# Altium schematic sheet v0.SchDoc
size A
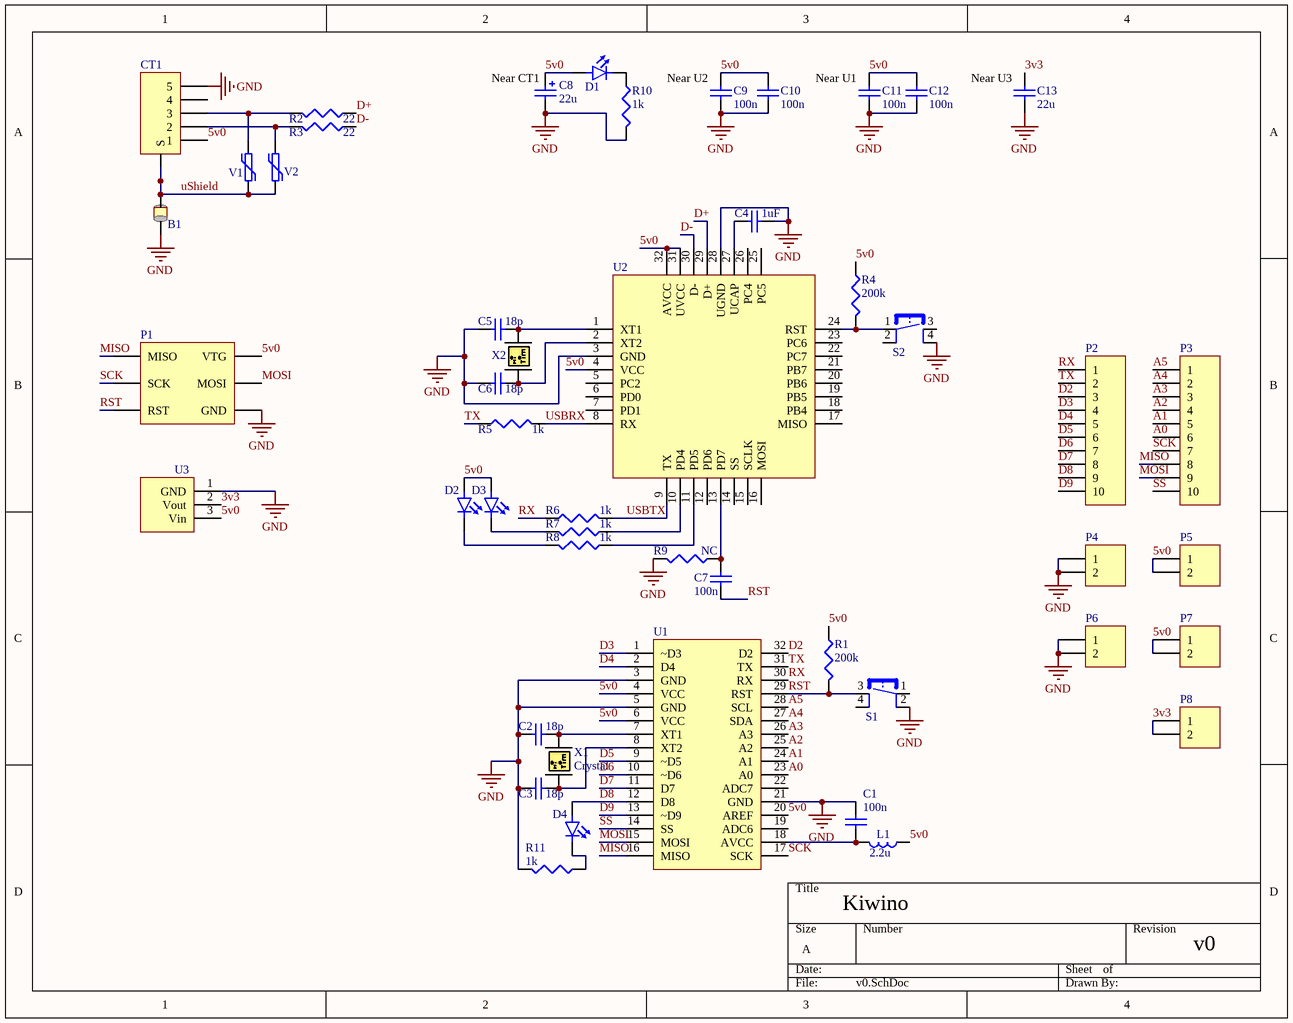
[diagram p0: v0.SchDoc]

## Parts
B1  Ferrite Bead  [smd0603]  (value not drawn)
C1  value 100n  [SMD0603_cap]  (hidden comment: Cap)
C2  value 18p  [SMD0603_cap]  (hidden comment: Cap)
C3  value 18p  [SMD0603_cap]  (hidden comment: Cap)
C4  value 1uF  [SMD0603_cap]  (hidden comment: Cap)
C5  value 18p  [SMD0603_cap]  (hidden comment: Cap)
C6  value 18p  [SMD0603_cap]  (hidden comment: Cap)
C7  value 100n  [SMD0603_cap]  (hidden comment: Cap)
C8  value 22u  [cap_radial_b]  (hidden comment: Cap)
C9  value 100n  [SMD0603_cap]  (hidden comment: Cap)
C10  value 100n  [SMD0603_cap]  (hidden comment: Cap)
C11  value 100n  [SMD0603_cap]  (hidden comment: Cap)
C12  value 100n  [SMD0603_cap]  (hidden comment: Cap)
C13  value 22u  [SMD0603_cap]  (hidden comment: Cap)
CT1  Header  [microusb_2]  (value not drawn)
D1  LED  [SMD0603 POLARIZED]  (value not drawn)
D2  LED  [SMD0603 POLARIZED]  (value not drawn)
D3  LED  [SMD0603 POLARIZED]  (value not drawn)
D4  LED  [SMD0603 POLARIZED]  (value not drawn)
L1  value 2.2u  [SMD0805]  (hidden comment: Inductor)
P1  ICSP Header  [Header 2x3]  (value not drawn)
P2  Header 10x1  [header 10x1]  (value not drawn)
P3  Header 10x1  [header 10x1]  (value not drawn)
P4  Header  [Header 2x1]  (value not drawn)
P5  Header  [Header 2x1]  (value not drawn)
P6  Header  [Header 2x1]  (value not drawn)
P7  Header  [Header 2x1]  (value not drawn)
P8  Header  [Header 2x1]  (value not drawn)
R1  value 200k  [SMD0603]  (hidden comment: Res)
R2  value 22  [SMD0603]  (hidden comment: Res)
R3  value 22  [SMD0603]  (hidden comment: Res)
R4  value 200k  [SMD0603]  (hidden comment: Res)
R5  value 1k  [SMD0603]  (hidden comment: Res)
R6  value 1k  [SMD0603]  (hidden comment: Res)
R7  value 1k  [SMD0603]  (hidden comment: Res)
R8  value 1k  [SMD0603]  (hidden comment: Res)
R9  value NC  [SMD0603]  (hidden comment: Res)
R10  value 1k  [SMD0603]  (hidden comment: Res)
R11  value 1k  [SMD0603]  (hidden comment: Res)
S1  Pushbutton  [pushbutton_smd]  (value not drawn)
S2  Pushbutton  [pushbutton_smd]  (value not drawn)
U1  ATMega328P_SMD  [tqfp-32]  (value not drawn)
U2  ATMega16U2  [tqfp-32]  (value not drawn)
U3  AZ1117CH  [sot-223]  (value not drawn)
V1  Varistor  [smd0603]  (value not drawn)
V2  Varistor  [smd0603]  (value not drawn)
X1  Crystal  [crystal_smd_2pin]
X2  Crystal  [crystal_smd_2pin]  (value not drawn)

## Nets
GND: B1.2 C1.2 C2.2 C3.2 C4.2 C5.2 C6.2 C8.2 C9.2 C10.2 C11.2 C12.2 C13.2 CT1.5 P1.6(GND) P4.1 P4.2 P6.1 P6.2 R9.2 R10.2 R11.2 S1.2 S2.4 U1.3(GND) U1.5(GND) U1.21(GND) U2.3(GND) U2.28(UGND) U3.1(GND)
3v3: C13.1 P8.1 P8.2 U3.2(Vout)
5v0: C8.1 C9.1 C10.1 C11.1 C12.1 CT1.1 D1.1(Anode_(+)) D2.1(Anode_(+)) D3.1(Anode_(+)) L1.1(Source) P1.2(VTG) P5.1 P5.2 P7.1 P7.2 R1.2 R4.2 U1.4(VCC) U1.6(VCC) U1.20(AREF) U2.4(VCC) U2.31(UVCC) U2.32(AVCC) U3.3(Vin)
A0: P3.6 U1.23(A0)
A1: P3.5 U1.24(A1)
A2: P3.4 U1.25(A2)
A3: P3.3 U1.26(A3)
A4: P3.2 U1.27(SDA)
A5: P3.1 U1.28(SCL)
D2: P2.3 U1.32(D2)
D3: P2.4 U1.1(~D3)
D4: P2.5 U1.2(D4)
D5: P2.6 U1.9(~D5)
D6: P2.7 U1.10(~D6)
D7: P2.8 U1.11(D7)
D8: D4.1(Anode_(+)) P2.9 U1.12(D8)
D9: P2.10 U1.13(~D9)
D+: R2.1 U2.29(D+)
D-: R3.1 U2.30(D-)
MISO: P1.1(MISO) P3.8 U1.16(MISO)
MOSI: P1.4(MOSI) P3.9 U1.15(MOSI)
RST: C7.2 P1.5(RST) R1.1 S1.3 U1.29(RST)
RX: P2.1 R6.1 U1.30(RX)
SCK: P1.3(SCK) P3.7 U1.17(SCK)
SS: P3.10 U1.14(SS)
TX: P2.2 R5.1 U1.31(TX)
USBRX: R5.2 U2.8(RX)
USBTX: R6.2 U2.9(TX)
uShield: B1.1 CT1.S V1.1 V2.1
NetC1_1: C1.1 L1.2(Source) U1.18(AVCC)
NetC2_1: C2.1 U1.7(XT1) X1.2
NetC3_1: C3.1 U1.8(XT2) X1.1
NetC4_1: C4.1 U2.27(UCAP)
NetC5_1: C5.1 U2.1(XT1) X2.2
NetC6_1: C6.1 U2.2(XT2) X2.1
NetC7_1: C7.1 R9.1 U2.13(PD7)
NetCT1_2: CT1.2 R3.2 V2.2
NetCT1_3: CT1.3 R2.2 V1.2
NetD1_2: D1.2(Cathode_(-)) R10.1
NetD2_2: D2.2(Cathode_(-)) R8.2
NetD3_2: D3.2(Cathode_(-)) R7.2
NetD4_2: D4.2(Cathode_(-)) R11.1
NetR4_1: R4.1 S2.1 U2.24(RST)
NetR7_1: R7.1 U2.10(PD4)
NetR8_1: R8.1 U2.11(PD5)

Not connected (* = marked no-connect by the designer): CT1 4; S1 1 4; S2 2 3; U1 19(ADC6) 22(ADC7); U2 5(PC2) 6(PD0) 7(PD1) 12(PD6) 14(SS) 15(SCLK) 16(MOSI) 17(MISO) 18(PB4) 19(PB5) 20(PB6) 21(PB7) 22(PC7) 23(PC6) 25(PC5) 26(PC4)

## Notes on the sheet
- (near C8) Near CT1
- (near C9) Near U2
- (near C11) Near U1
- (near C13) Near U3
- Kiwino
- v0

## Library data of the parts
C1-C7 C9-C13 = Capacitor Ceramic: Ceramic Chip Capacitor
C8 = Capacitor Polarized: Polarized Capacitor (Surface Mount)
CT1 = MICROUSB: Micro USB
L1 = Inductor: Code_IEC: 1005; Published: 8-Jun-2000; LatestRevisionDate: 29-May-2009; LatestRevisionNote: IPC-7351 Footprint Added.; PackageReference: 0402-A; Publisher: Altium Limited; PackageDescription: Chip Inductor; Code_JEITA: 0402
P4-P8 = Header 2x1: Header, 2-Pin
R1-R11 = Resistor